# Altium schematic sheet Sheet2.SchDoc
size A4
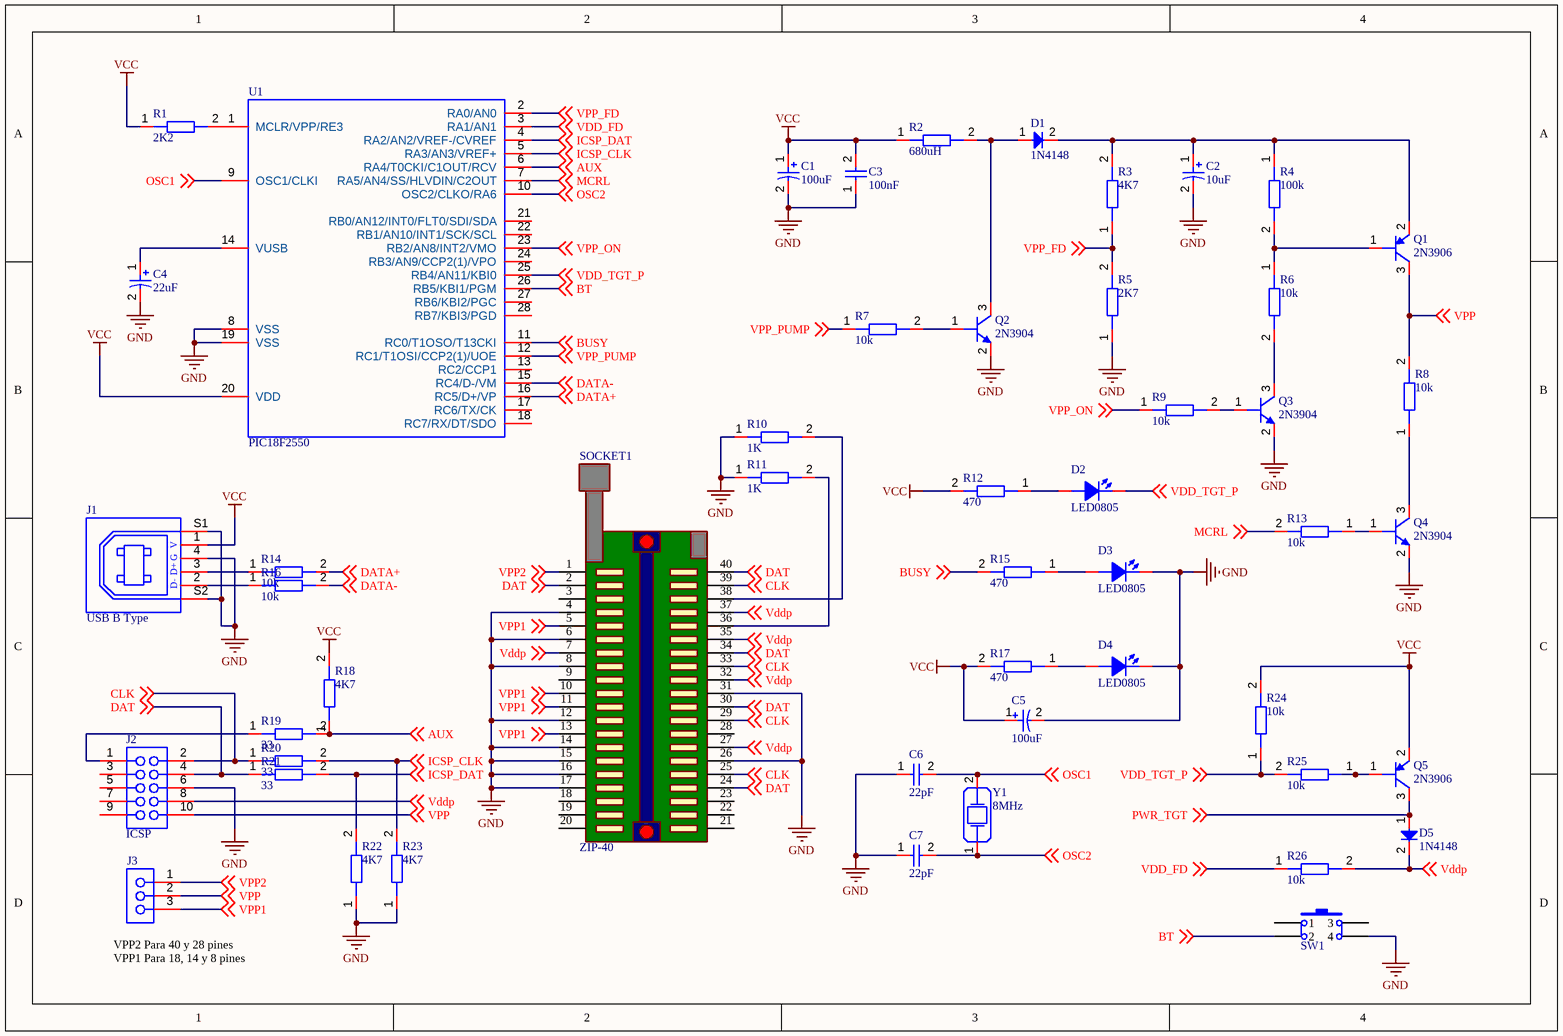
[diagram p0: Sheet2.SchDoc]

## Parts
C1  100uF  [CAP_6.3_100uF]
C2  10uF  [CAP_6.3_100uF]
C3  100nF  [C0805]
C4  22uF  [CAP_6.3_100uF]
C5  100uF  [CAP_6.3_100uF]
C6  22pF  [C0805]
C7  22pF  [C0805]
D1  1N4148  [DO-213AB]
D2  LED0805  [L0805RED]
D3  LED0805  [L0805RED]
D4  LED0805  [L0805RED]
D5  1N4148  [DO-213AB]
J1  USB B Type  [USB-B-TYPE]
J2  ICSP  [IDC_CONNECTOR_10x2.54]
J3  Header 3x1 TH Pitch 2.54mm  [Header 3x1 TH Pitch 2.54mm]  (value not drawn)
Q1  2N3906  [SOT23-3]
Q2  2N3904  [SOT23-3]
Q3  2N3904  [SOT23-3]
Q4  2N3904  [SOT23-3]
Q5  2N3906  [SOT23-3]
R1  2K2  [R0805]
R2  680uH  [RES-0.5W-HH-MO]
R3  4K7  [R0805]
R4  100k  [R0805]
R5  2K7  [R0805]
R6  10k  [R0805]
R7  10k  [R0805]
R8  10k  [R0805]
R9  10k  [R0805]
R10  1K  [R0805]
R11  1K  [R0805]
R12  470  [R0805]
R13  10k  [R0805]
R14  10k  [R0805]
R15  470  [R0805]
R16  10k  [R0805]
R17  470  [R0805]
R18  4K7  [R0805]
R19  33  [R0805]
R20  33  [R0805]
R21  33  [R0805]
R22  4K7  [R0805]
R23  4K7  [R0805]
R24  10k  [R0805]
R25  10k  [R0805]
R26  10k  [R0805]
SOCKET1  ZIP-40  [ZIP-40]
SW1  Button1  [BUTTON_HOLE_4.3mm]  (value not drawn)
U1  PIC18F2550  [DIP28_M04]
Y1  8MHz  [HC-49_THROUGH]

## Nets
GND: C1.2 C2.2 C3.1 C4.2 C5.2 C6.1 C7.1 D3.2(K) D4.2(K) J1.4 J1.S1 J1.S2 J2.6 Q2.2(E) Q3.2(E) Q4.2(E) R5.1 R10.1 R11.1 R22.1 R23.1 SOCKET1.4 SOCKET1.6 SOCKET1.8 SOCKET1.12 SOCKET1.14 SOCKET1.15 SOCKET1.16 SOCKET1.17 SOCKET1.26 SOCKET1.31 SW1.4 U1.8(VSS) U1.19(VSS)
VCC: C1.1 C3.2 C5.1 J1.1 Q5.2(E) R1.1 R2.1 R12.2 R17.2 R18.2 R24.2 U1.20(VDD)
AUX: R18.1 R19.2 U1.6(RA4/T0CKI/C1OUT/RCV) ; off-sheet AUX
BT: SW1.2 U1.26(RB5/KBI1/PGM) ; off-sheet BT
BUSY: R15.2 U1.11(RC0/T1OSO/T13CKI) ; off-sheet BUSY
CLK: J2.2 R20.1 SOCKET1.25 SOCKET1.29 SOCKET1.33 SOCKET1.39 ; off-sheet CLK
DAT: J2.4 R21.1 SOCKET1.2 SOCKET1.24 SOCKET1.30 SOCKET1.34 SOCKET1.40 ; off-sheet DAT
DATA+: R14.2 U1.16(RC5/D+/VP) ; off-sheet DATA+
DATA-: R16.2 U1.15(RC4/D-/VM) ; off-sheet DATA-
ICSP_CLK: R20.2 R23.2 U1.5(RA3/AN3/VREF+) ; off-sheet ICSP_CLK
ICSP_DAT: R21.2 R22.2 U1.4(RA2/AN2/VREF-/CVREF) ; off-sheet ICSP_DAT
MCRL: R13.2 U1.7(RA5/AN4/SS/HLVDIN/C2OUT) ; off-sheet MCRL
OSC1: C6.2 U1.9(OSC1/CLKI) Y1.2 ; off-sheet OSC1
OSC2: C7.2 U1.10(OSC2/CLKO/RA6) Y1.1 ; off-sheet OSC2
PWR_TGT: D5.1 Q5.3(C) ; off-sheet PWR_TGT
VDD_FD: R26.1 U1.3(RA1/AN1) ; off-sheet VDD_FD
VDD_TGT_P: D2.2(K) R24.1 R25.2 U1.25(RB4/AN11/KBI0) ; off-sheet VDD_TGT_P
Vddp: D5.2 J2.8 R26.2 SOCKET1.7 SOCKET1.27 SOCKET1.32 SOCKET1.35 SOCKET1.37 ; off-sheet Vddp
VPP: J2.10 J3.2 Q1.3(C) R8.2 ; off-sheet VPP
VPP1: J3.3 SOCKET1.5 SOCKET1.10 SOCKET1.11 SOCKET1.13 ; off-sheet VPP1
VPP2: J3.1 SOCKET1.1 ; off-sheet VPP2
VPP_FD: R3.1 R5.2 U1.2(RA0/AN0) ; off-sheet VPP_FD
VPP_ON: R9.1 U1.23(RB2/AN8/INT2/VMO) ; off-sheet VPP_ON
VPP_PUMP: R7.1 U1.12(RC1/T1OSI/CCP2(1)/UOE) ; off-sheet VPP_PUMP
NetC2_1: C2.1 D1.2 Q1.2(E) R3.2 R4.1
NetC4_1: C4.1 U1.14(VUSB)
NetD1_1: D1.1 Q2.3(C) R2.2
NetD2_1: D2.1(A) R12.1
NetD3_1: D3.1(A) R15.1
NetD4_1: D4.1(A) R17.1
NetJ1_2: J1.2 R16.1
NetJ1_3: J1.3 R14.1
NetJ2_1: J2.1 R19.1
NetQ1_1: Q1.1(B) R4.2 R6.1
NetQ2_1: Q2.1(B) R7.2
NetQ3_1: Q3.1(B) R9.2
NetQ3_3: Q3.3(C) R6.2
NetQ4_1: Q4.1(B) R13.1
NetQ4_3: Q4.3(C) R8.1
NetQ5_1: Q5.1(B) R25.1
NetR1_2: R1.2 U1.1(MCLR/VPP/RE3)
NetR10_2: R10.2 SOCKET1.38
NetR11_2: R11.2 SOCKET1.36

Not connected (* = marked no-connect by the designer): J2 3 5 7 9; SOCKET1 3 9 18 19 20 21 22 23 28; SW1 1 3; U1 13(RC2/CCP1) 17(RC6/TX/CK) 18(RC7/RX/DT/SDO) 21(RB0/AN12/INT0/FLT0/SDI/SDA) 22(RB1/AN10/INT1/SCK/SCL) 24(RB3/AN9/CCP2(1)/VPO) 27(RB6/KBI2/PGC) 28(RB7/KBI3/PGD)

## Notes on the sheet
- (near J3) VPP2 Para 40 y 28 pines
  VPP1 Para 18, 14 y 8 pines
- (in symbol USB B Type) V; G; D+; D-

## Library data of the parts
C1 C2 C4 C5 = Capacitor(Radian)
C3 C6 C7 = Capacitors(SMD)
D1 D5 = Diode 1N4148 SMD
J2 = IDC_CONNECTOR_5x2
R1 R3-R26 = Resistor SMD
R2 = Resistors THD
Y1 = Crystal